# Altium schematic sheet 模拟量输入输出.SchDoc
size A1
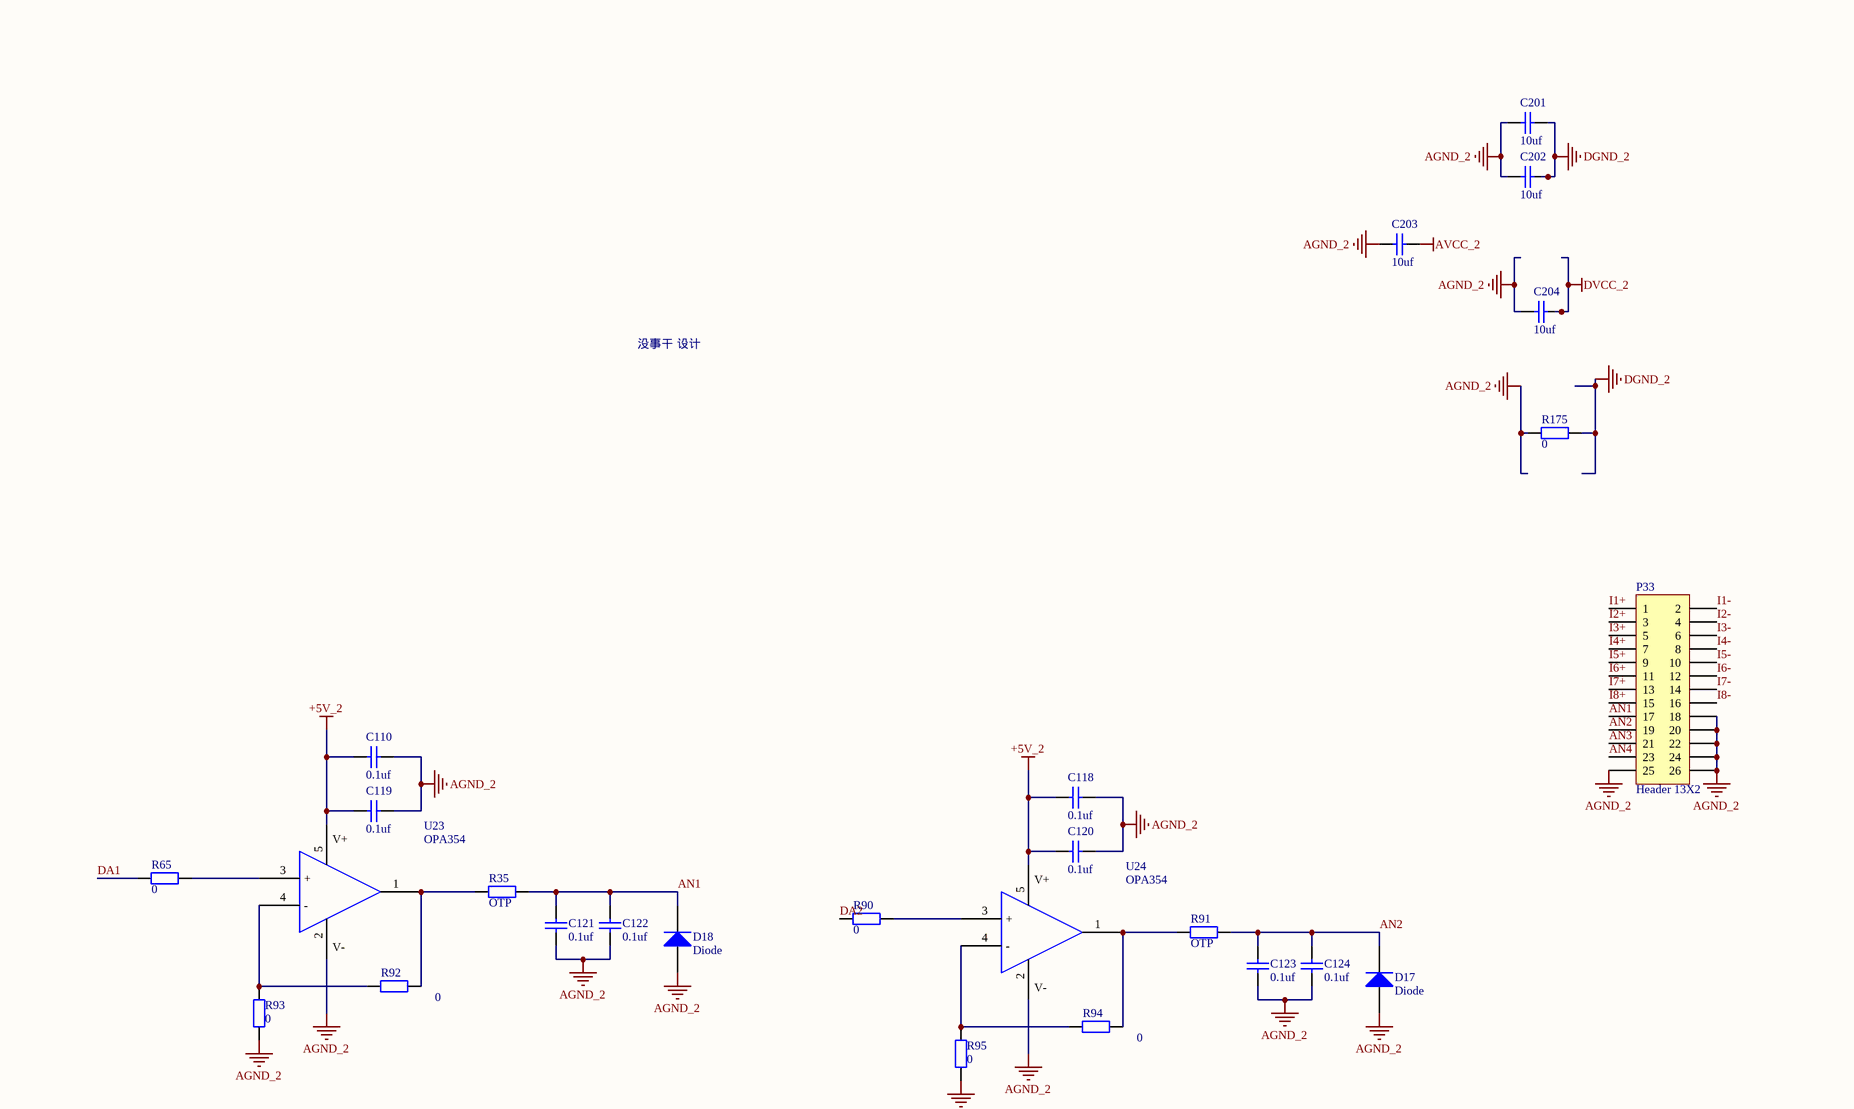
[diagram p0: 模拟量输入输出.SchDoc, top left]
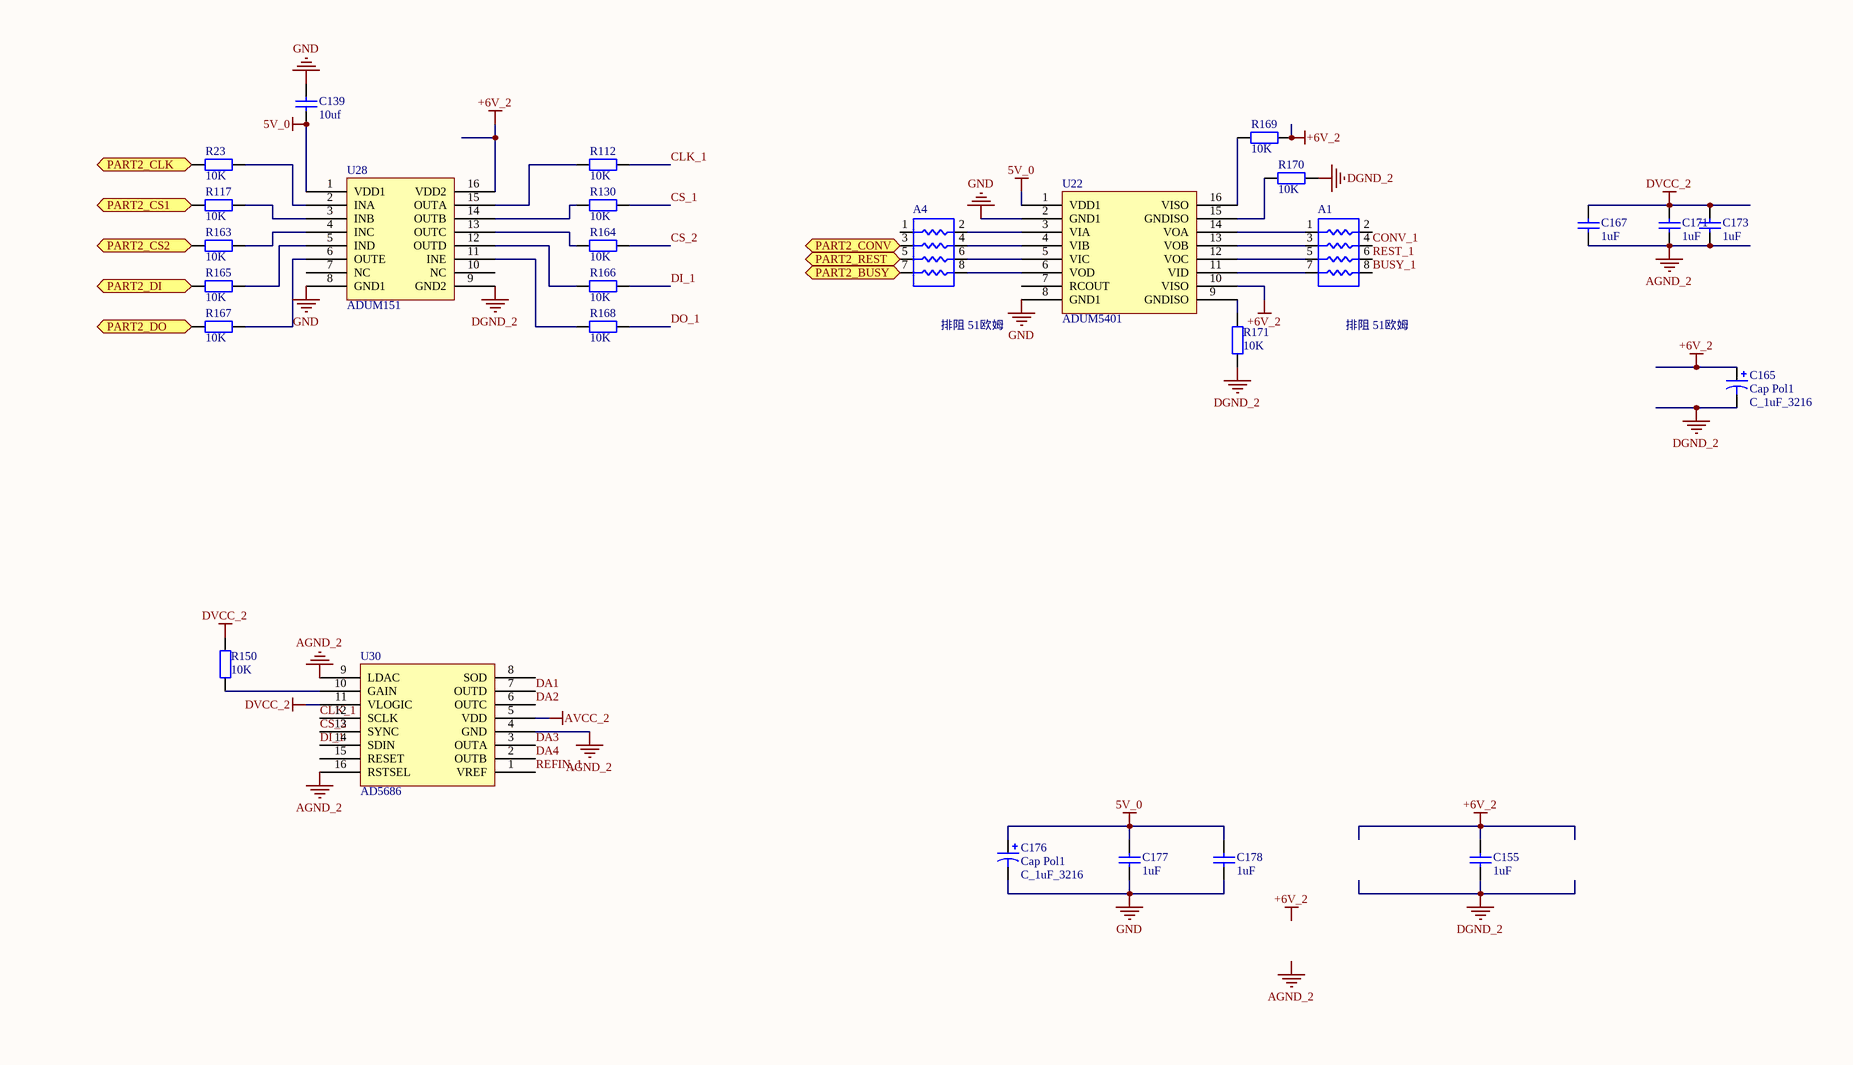
[diagram p1: 模拟量输入输出.SchDoc, top right]
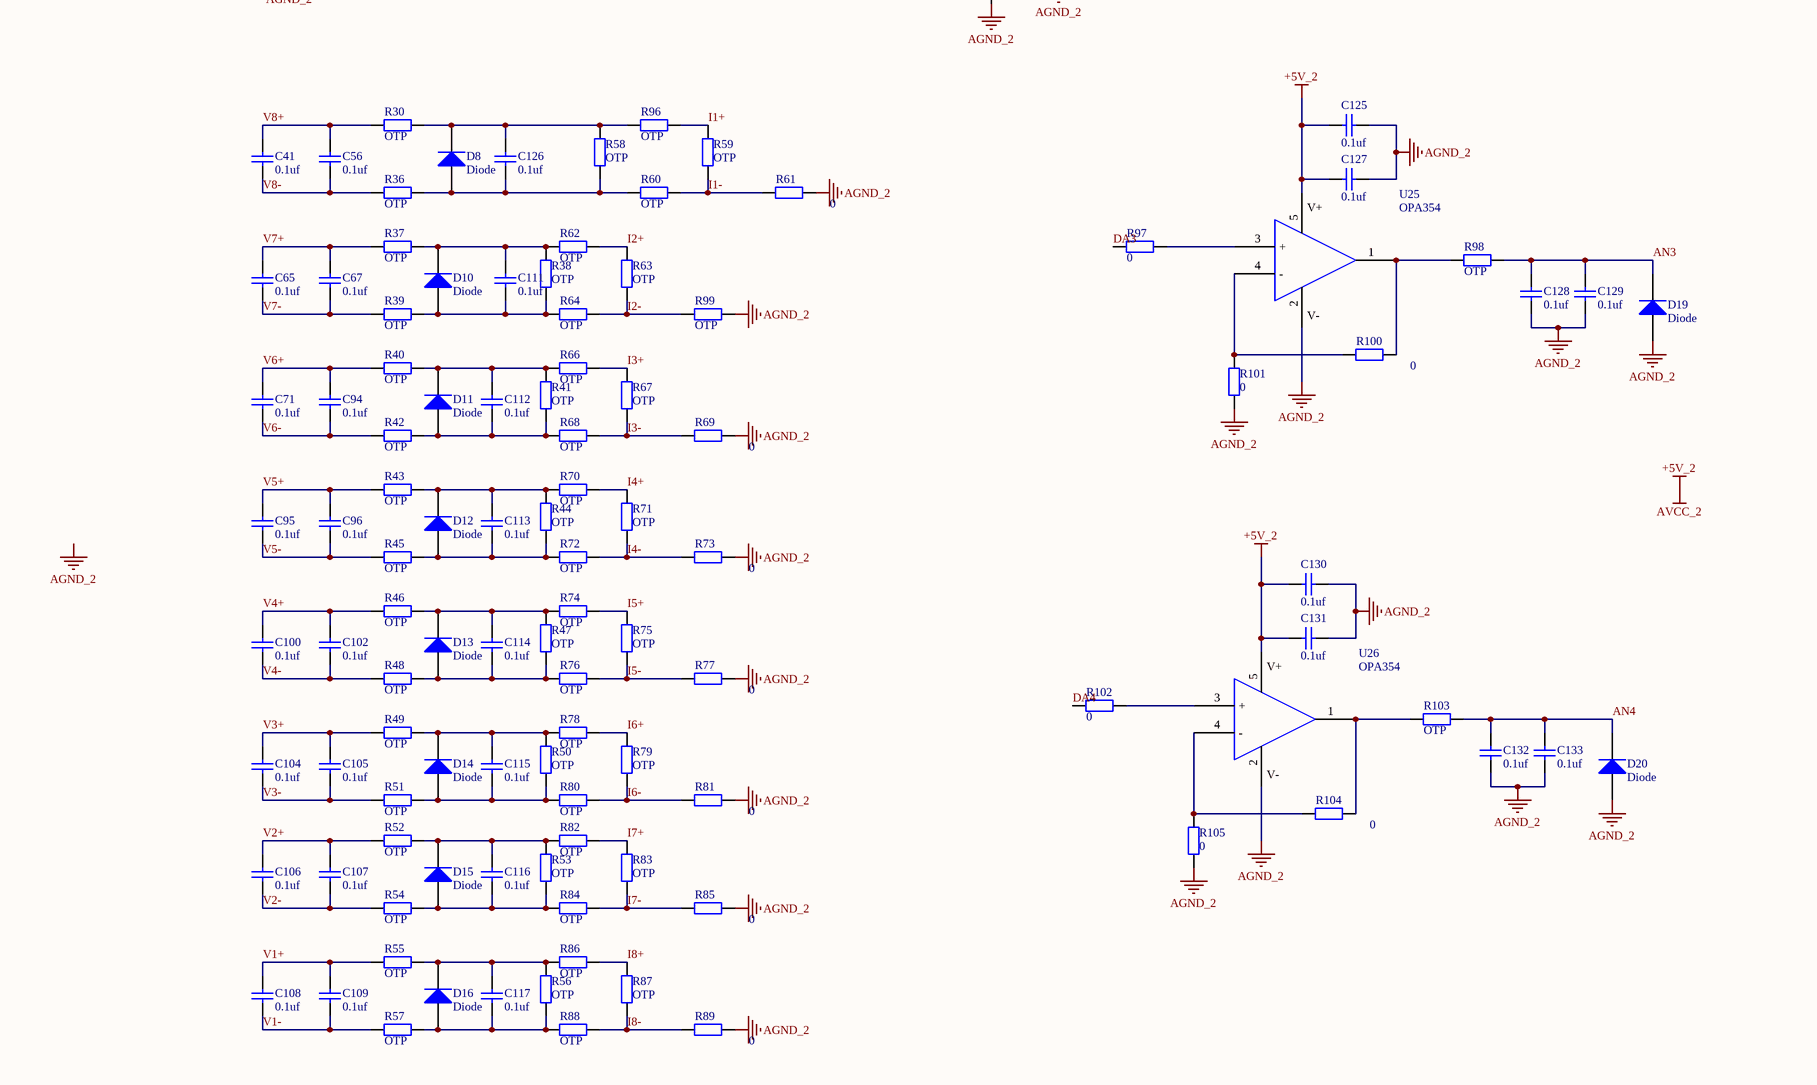
[diagram p2: 模拟量输入输出.SchDoc, bottom left]
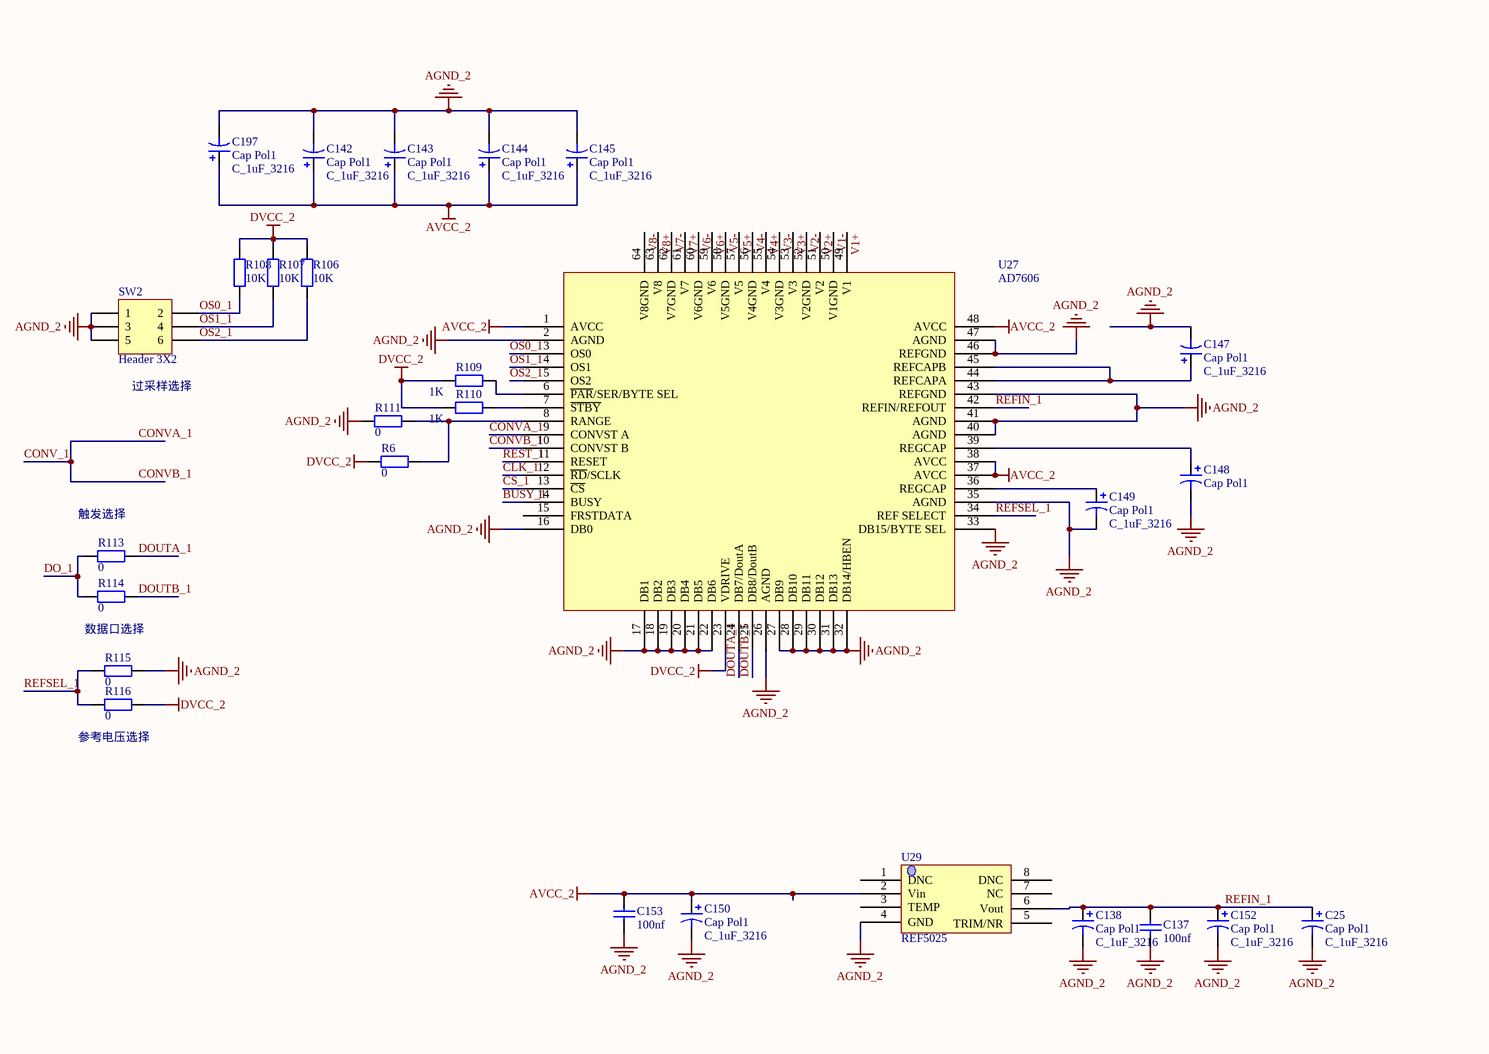
[diagram p3: 模拟量输入输出.SchDoc, bottom right]

## Parts
A1  排阻 51欧姆  [RCA03-4D]
A4  排阻 51欧姆  [RCA03-4D]
C25  Cap Pol1  value C_1uF_3216  [3216]
C41  value 0.1uf  [0805C]  (hidden comment: Cap)
C56  value 0.1uf  [0805C]  (hidden comment: Cap)
C65  value 0.1uf  [0805C]  (hidden comment: Cap)
C67  value 0.1uf  [0805C]  (hidden comment: Cap)
C71  value 0.1uf  [0805C]  (hidden comment: Cap)
C94  value 0.1uf  [0805C]  (hidden comment: Cap)
C95  value 0.1uf  [0805C]  (hidden comment: Cap)
C96  value 0.1uf  [0805C]  (hidden comment: Cap)
C100  value 0.1uf  [0805C]  (hidden comment: Cap)
C102  value 0.1uf  [0805C]  (hidden comment: Cap)
C104  value 0.1uf  [0805C]  (hidden comment: Cap)
C105  value 0.1uf  [0805C]  (hidden comment: Cap)
C106  value 0.1uf  [0805C]  (hidden comment: Cap)
C107  value 0.1uf  [0805C]  (hidden comment: Cap)
C108  value 0.1uf  [0805C]  (hidden comment: Cap)
C109  value 0.1uf  [0805C]  (hidden comment: Cap)
C110  value 0.1uf  [0805C]  (hidden comment: Cap)
C111  value 0.1uf  [0805C]  (hidden comment: Cap)
C112  value 0.1uf  [0805C]  (hidden comment: Cap)
C113  value 0.1uf  [0805C]  (hidden comment: Cap)
C114  value 0.1uf  [0805C]  (hidden comment: Cap)
C115  value 0.1uf  [0805C]  (hidden comment: Cap)
C116  value 0.1uf  [0805C]  (hidden comment: Cap)
C117  value 0.1uf  [0805C]  (hidden comment: Cap)
C118  value 0.1uf  [0805C]  (hidden comment: Cap)
C119  value 0.1uf  [0805C]  (hidden comment: Cap)
C120  value 0.1uf  [0805C]  (hidden comment: Cap)
C121  value 0.1uf  [0805C]  (hidden comment: Cap)
C122  value 0.1uf  [0805C]  (hidden comment: Cap)
C123  value 0.1uf  [0805C]  (hidden comment: Cap)
C124  value 0.1uf  [0805C]  (hidden comment: Cap)
C125  value 0.1uf  [0805C]  (hidden comment: Cap)
C126  value 0.1uf  [0805C]  (hidden comment: Cap)
C127  value 0.1uf  [0805C]  (hidden comment: Cap)
C128  value 0.1uf  [0805C]  (hidden comment: Cap)
C129  value 0.1uf  [0805C]  (hidden comment: Cap)
C130  value 0.1uf  [0805C]  (hidden comment: Cap)
C131  value 0.1uf  [0805C]  (hidden comment: Cap)
C132  value 0.1uf  [0805C]  (hidden comment: Cap)
C133  value 0.1uf  [0805C]  (hidden comment: Cap)
C137  value 100nf  [0805C]  (hidden comment: Cap)
C138  Cap Pol1  value C_1uF_3216  [3216]
C139  value 10uf  [0805C]  (hidden comment: Cap)
C142  Cap Pol1  value C_1uF_3216  [3216]
C143  Cap Pol1  value C_1uF_3216  [3216]
C144  Cap Pol1  value C_1uF_3216  [3216]
C145  Cap Pol1  value C_1uF_3216  [3216]
C147  Cap Pol1  value C_1uF_3216  [3216]
C148  Cap Pol1  [3216]
C149  Cap Pol1  value C_1uF_3216  [3216]
C150  Cap Pol1  value C_1uF_3216  [3216]
C152  Cap Pol1  value C_1uF_3216  [3216]
C153  value 100nf  [0805C]  (hidden comment: Cap)
C155  1uF  [0805C]
C165  Cap Pol1  value C_1uF_3216  [3216]
C167  1uF  [0805C]
C171  1uF  [0805C]
C173  1uF  [0805C]
C176  Cap Pol1  value C_1uF_3216  [3216]
C177  1uF  [0805C]
C178  1uF  [0805C]
C197  Cap Pol1  value C_1uF_3216  [3216]
C201  value 10uf  [0805C]  (hidden comment: Cap)
C202  value 10uf  [0805C]  (hidden comment: Cap)
C203  value 10uf  [0805C]  (hidden comment: Cap)
C204  value 10uf  [0805C]  (hidden comment: Cap)
D8  Diode  [SMA]
D10  Diode  [SMA]
D11  Diode  [SMA]
D12  Diode  [SMA]
D13  Diode  [SMA]
D14  Diode  [SMA]
D15  Diode  [SMA]
D16  Diode  [SMA]
D17  Diode  [SMA]
D18  Diode  [SMA]
D19  Diode  [SMA]
D20  Diode  [SMA]
P33  Header 13X2  [3.5MM-2*12P]
R6  value 0  [0805R]  (hidden comment: Res2)
R23  value 10K  [0805R]  (hidden comment: Res2)
R30  value OTP  [0805R]  (hidden comment: Res2)
R35  value OTP  [0805R]  (hidden comment: Res2)
R36  value OTP  [0805R]  (hidden comment: Res2)
R37  value OTP  [0805R]  (hidden comment: Res2)
R38  value OTP  [0805R]  (hidden comment: Res2)
R39  value OTP  [0805R]  (hidden comment: Res2)
R40  value OTP  [0805R]  (hidden comment: Res2)
R41  value OTP  [0805R]  (hidden comment: Res2)
R42  value OTP  [0805R]  (hidden comment: Res2)
R43  value OTP  [0805R]  (hidden comment: Res2)
R44  value OTP  [0805R]  (hidden comment: Res2)
R45  value OTP  [0805R]  (hidden comment: Res2)
R46  value OTP  [0805R]  (hidden comment: Res2)
R47  value OTP  [0805R]  (hidden comment: Res2)
R48  value OTP  [0805R]  (hidden comment: Res2)
R49  value OTP  [0805R]  (hidden comment: Res2)
R50  value OTP  [0805R]  (hidden comment: Res2)
R51  value OTP  [0805R]  (hidden comment: Res2)
R52  value OTP  [0805R]  (hidden comment: Res2)
R53  value OTP  [0805R]  (hidden comment: Res2)
R54  value OTP  [0805R]  (hidden comment: Res2)
R55  value OTP  [0805R]  (hidden comment: Res2)
R56  value OTP  [0805R]  (hidden comment: Res2)
R57  value OTP  [0805R]  (hidden comment: Res2)
R58  value OTP  [0805R]  (hidden comment: Res2)
R59  value OTP  [FB1206]  (hidden comment: Res2)
R60  value OTP  [0805R]  (hidden comment: Res2)
R61  value 0  [0603AR]  (hidden comment: Res2)
R62  value OTP  [0805R]  (hidden comment: Res2)
R63  value OTP  [FB1206]  (hidden comment: Res2)
R64  value OTP  [0805R]  (hidden comment: Res2)
R65  value 0  [0805R]  (hidden comment: Res2)
R66  value OTP  [0805R]  (hidden comment: Res2)
R67  value OTP  [FB1206]  (hidden comment: Res2)
R68  value OTP  [0805R]  (hidden comment: Res2)
R69  value 0  [0603AR]  (hidden comment: Res2)
R70  value OTP  [0805R]  (hidden comment: Res2)
R71  value OTP  [FB1206]  (hidden comment: Res2)
R72  value OTP  [0805R]  (hidden comment: Res2)
R73  value 0  [0603AR]  (hidden comment: Res2)
R74  value OTP  [0805R]  (hidden comment: Res2)
R75  value OTP  [FB1206]  (hidden comment: Res2)
R76  value OTP  [0805R]  (hidden comment: Res2)
R77  value 0  [0603AR]  (hidden comment: Res2)
R78  value OTP  [0805R]  (hidden comment: Res2)
R79  value OTP  [FB1206]  (hidden comment: Res2)
R80  value OTP  [0805R]  (hidden comment: Res2)
R81  value 0  [0603AR]  (hidden comment: Res2)
R82  value OTP  [0805R]  (hidden comment: Res2)
R83  value OTP  [FB1206]  (hidden comment: Res2)
R84  value OTP  [0805R]  (hidden comment: Res2)
R85  value 0  [0603AR]  (hidden comment: Res2)
R86  value OTP  [0805R]  (hidden comment: Res2)
R87  value OTP  [FB1206]  (hidden comment: Res2)
R88  value OTP  [0805R]  (hidden comment: Res2)
R89  value 0  [0603AR]  (hidden comment: Res2)
R90  value 0  [0805R]  (hidden comment: Res2)
R91  value OTP  [0805R]  (hidden comment: Res2)
R92  value 0  [0805R]  (hidden comment: Res2)
R93  value 0  [0805R]  (hidden comment: Res2)
R94  value 0  [0805R]  (hidden comment: Res2)
R95  value 0  [0805R]  (hidden comment: Res2)
R96  value OTP  [0805R]  (hidden comment: Res2)
R97  value 0  [0805R]  (hidden comment: Res2)
R98  value OTP  [0805R]  (hidden comment: Res2)
R99  value OTP  [0603AR]  (hidden comment: Res2)
R100  value 0  [0805R]  (hidden comment: Res2)
R101  value 0  [0805R]  (hidden comment: Res2)
R102  value 0  [0805R]  (hidden comment: Res2)
R103  value OTP  [0805R]  (hidden comment: Res2)
R104  value 0  [0805R]  (hidden comment: Res2)
R105  value 0  [0805R]  (hidden comment: Res2)
R106  value 10K  [0805R]  (hidden comment: Res2)
R107  value 10K  [0805R]  (hidden comment: Res2)
R108  value 10K  [0805R]  (hidden comment: Res2)
R109  value 1K  [0805R]  (hidden comment: Res2)
R110  value 1K  [0805R]  (hidden comment: Res2)
R111  value 0  [0805R]  (hidden comment: Res2)
R112  value 10K  [0805R]  (hidden comment: Res2)
R113  value 0  [0805R]  (hidden comment: Res2)
R114  value 0  [0805R]  (hidden comment: Res2)
R115  value 0  [0805R]  (hidden comment: Res2)
R116  value 0  [0805R]  (hidden comment: Res2)
R117  value 10K  [0805R]  (hidden comment: Res2)
R130  value 10K  [0805R]  (hidden comment: Res2)
R150  value 10K  [0805R]  (hidden comment: Res2)
R163  value 10K  [0805R]  (hidden comment: Res2)
R164  value 10K  [0805R]  (hidden comment: Res2)
R165  value 10K  [0805R]  (hidden comment: Res2)
R166  value 10K  [0805R]  (hidden comment: Res2)
R167  value 10K  [0805R]  (hidden comment: Res2)
R168  value 10K  [0805R]  (hidden comment: Res2)
R169  value 10K  [0603AR]  (hidden comment: Res2)
R170  value 10K  [0603AR]  (hidden comment: Res2)
R171  value 10K  [0603AR]  (hidden comment: Res2)
R175  value 0  [0805R]  (hidden comment: Res2)
SW2  Header 3X2  [SW_6]
U22  ADUM5401  [SOL-16_L]
U23  OPA354  [SOT23-5]
U24  OPA354  [SOT23-5]
U25  OPA354  [SOT23-5]
U26  OPA354  [SOT23-5]
U27  AD7606  [TQFP64]
U28  ADUM151  [SO16NB]
U29  REF5025  [MSOP8]
U30  AD5686  [TSSOP16]

## Ports
PART2_BUSY, PART2_CLK, PART2_CONV, PART2_CS1, PART2_CS2, PART2_DI, PART2_DO, PART2_REST

## Nets
5V_0: C139.2 C176.1 C177.1 C178.1 U22.1(VDD1) U28.1(VDD1)
+5V_2: C110.2 C118.2 C119.2 C120.2 C125.2 C127.2 C130.2 C131.2 C142.1 C143.1 C144.1 C145.1 C150.1 C153.2 C197.1 C203.1 U23.5(V+) U24.5(V+) U25.5(V+) U26.5(V+) U27.1(AVCC) U27.37(AVCC) U27.38(AVCC) U27.48(AVCC) U29.2(Vin) U30.5(VDD)  [also labelled AVCC_2]
+6V_2: C155.1 C165.1 R169.1 U22.10(VISO) U28.16(VDD2)
AGND_2: C25.2 C110.1 C118.1 C119.1 C120.1 C121.1 C122.1 C123.1 C124.1 C125.1 C127.1 C128.1 C129.1 C130.1 C131.1 C132.1 C133.1 C137.1 C138.2 C142.2 C143.2 C144.2 C145.2 C147.2 C148.2 C149.2 C150.2 C152.2 C153.1 C167.2 C171.2 C173.2 C197.2 C201.2 C202.2 C203.2 C204.2 D17.1(A) D18.1(A) D19.1(A) D20.1(A) P33.18 P33.20 P33.22 P33.24 P33.25 P33.26 R61.1 R69.1 R73.1 R77.1 R81.1 R85.1 R89.1 R93.2 R95.2 R99.1 R101.2 R105.2 R111.2 R115.1 R175.2 SW2.1 SW2.3 SW2.5 U23.2(V-) U24.2(V-) U25.2(V-) U26.2(V-) U27.2(AGND) U27.16(DB0) U27.17(DB1) U27.18(DB2) U27.19(DB3) U27.20(DB4) U27.21(DB5) U27.22(DB6) U27.26(AGND) U27.27(DB9) U27.28(DB10) U27.29(DB11) U27.30(DB12) U27.31(DB13) U27.32(DB14/HBEN) U27.33(DB15/BYTE_SEL) U27.35(AGND) U27.40(AGND) U27.41(AGND) U27.43(REFGND) U27.46(REFGND) U27.47(AGND) U29.4(GND) U30.4(GND) U30.9(LDAC) U30.16(RSTSEL)
DGND_2: C155.2 C165.2 C201.1 C202.1 R170.1 R171.2 R175.1 U28.9(GND2)
DVCC_2: C167.1 C171.1 C173.1 C204.1 R6.2 R106.1 R107.1 R108.1 R109.2 R110.2 R116.1 R150.1 U27.23(VDRIVE) U30.11(VLOGIC)
GND: C139.1 C176.2 C177.2 C178.2 U22.2(GND1) U22.8(GND1) U28.8(GND1)
AN1: C121.2 C122.2 D18.2(K) P33.17 R35.2
AN2: C123.2 C124.2 D17.2(K) P33.19 R91.2
AN3: C128.2 C129.2 D19.2(K) P33.21 R98.2
AN4: C132.2 C133.2 D20.2(K) P33.23 R103.2
BUSY_1: A1.8 U27.14(BUSY)
CLK_1: R112.1 U27.12(~{RD}/SCLK) U30.12(SCLK)
CONV_1: A1.4 U27.9(CONVST_A) U27.10(CONVST_B)  [also labelled CONVA_1, CONVB_1]
CS_1: R130.1 U27.13(~{CS})
CS_2: R164.1 U30.13(SYNC)
DA1: R65.1 U30.7(OUTD)
DA2: R90.1 U30.6(OUTC)
DA3: R97.1 U30.3(OUTA)
DA4: R102.1 U30.2(OUTB)
DI_1: R166.1 U30.14(SDIN)
DO_1: R113.1 R114.1 R168.1
DOUTA_1: R113.2 U27.24(DB7/DoutA)
DOUTB_1: R114.2 U27.25(DB8/DoutB)
I1+: P33.1 R59.2 R96.2
I1-: P33.2 R59.1 R60.2 R61.2
I2+: P33.3 R62.2 R63.1
I2-: P33.4 R63.2 R64.2 R99.2
I3+: P33.5 R66.2 R67.1
I3-: P33.6 R67.2 R68.2 R69.2
I4+: P33.7 R70.2 R71.1
I4-: P33.8 R71.2 R72.2 R73.2
I5+: P33.9 R74.2 R75.1
I5-: P33.10 R75.2 R76.2 R77.2
I6+: P33.11 R78.2 R79.1
I6-: P33.12 R79.2 R80.2 R81.2
I7+: P33.13 R82.2 R83.1
I7-: P33.14 R83.2 R84.2 R85.2
I8+: P33.15 R86.2 R87.1
I8-: P33.16 R87.2 R88.2 R89.2
OS0_1: R108.2 SW2.2 U27.3(OS0)
OS1_1: R107.2 SW2.4 U27.4(OS1)
OS2_1: R106.2 SW2.6 U27.5(OS2)
PART2_BUSY: A4.7 ; port PART2_BUSY
PART2_CLK: R23.2 ; port PART2_CLK
PART2_CONV: A4.3 ; port PART2_CONV
PART2_CS1: R117.2 ; port PART2_CS1
PART2_CS2: R163.2 ; port PART2_CS2
PART2_DI: R165.2 ; port PART2_DI
PART2_DO: R167.2 ; port PART2_DO
PART2_REST: A4.5 ; port PART2_REST
REFIN_1: C25.1 C137.2 C138.1 C152.1 U27.42(REFIN/REFOUT) U29.6(Vout) U30.1(VREF)
REFSEL_1: R115.2 R116.2 U27.34(REF_SELECT)
REST_1: A1.6 U27.11(RESET)
V1+: C108.2 C109.2 R55.2 U27.49(V1)
V1-: C108.1 C109.1 R57.2 U27.50(V1GND)
V2+: C106.2 C107.2 R52.2 U27.51(V2)
V2-: C106.1 C107.1 R54.2 U27.52(V2GND)
V3+: C104.2 C105.2 R49.2 U27.53(V3)
V3-: C104.1 C105.1 R51.2 U27.54(V3GND)
V4+: C100.2 C102.2 R46.2 U27.55(V4)
V4-: C100.1 C102.1 R48.2 U27.56(V4GND)
V5+: C95.2 C96.2 R43.2 U27.57(V5)
V5-: C95.1 C96.1 R45.2 U27.58(V5GND)
V6+: C71.2 C94.2 R40.2 U27.59(V6)
V6-: C71.1 C94.1 R42.2 U27.60(V6GND)
V7+: C65.2 C67.2 R37.2 U27.61(V7)
V7-: C65.1 C67.1 R39.2 U27.62(V7GND)
V8+: C41.2 C56.2 R30.2 U27.63(V8)
V8-: C41.1 C56.1 R36.2 U27.64(V8GND)
NetA1_1: A1.1 U22.14(VOA)
NetA1_3: A1.3 U22.13(VOB)
NetA1_5: A1.5 U22.12(VOC)
NetA1_7: A1.7 U22.11(VID)
NetA4_2: A4.2 U22.3(VIA)
NetA4_4: A4.4 U22.4(VIB)
NetA4_6: A4.6 U22.5(VIC)
NetA4_8: A4.8 U22.6(VOD)
NetC111_1: C111.1 D10.1(A) R38.2 R39.1 R64.1
NetC111_2: C111.2 D10.2(K) R37.1 R38.1 R62.1
NetC112_1: C112.1 D11.1(A) R41.2 R42.1 R68.1
NetC112_2: C112.2 D11.2(K) R40.1 R41.1 R66.1
NetC113_1: C113.1 D12.1(A) R44.2 R45.1 R72.1
NetC113_2: C113.2 D12.2(K) R43.1 R44.1 R70.1
NetC114_1: C114.1 D13.1(A) R47.2 R48.1 R76.1
NetC114_2: C114.2 D13.2(K) R46.1 R47.1 R74.1
NetC115_1: C115.1 D14.1(A) R50.2 R51.1 R80.1
NetC115_2: C115.2 D14.2(K) R49.1 R50.1 R78.1
NetC116_1: C116.1 D15.1(A) R53.2 R54.1 R84.1
NetC116_2: C116.2 D15.2(K) R52.1 R53.1 R82.1
NetC117_1: C117.1 D16.1(A) R56.2 R57.1 R88.1
NetC117_2: C117.2 D16.2(K) R55.1 R56.1 R86.1
NetC126_1: C126.1 D8.1(A) R36.1 R58.1 R60.1
NetC126_2: C126.2 D8.2(K) R30.1 R58.2 R96.1
NetC147_1: C147.1 U27.44(REFCAPA) U27.45(REFCAPB)
NetC148_1: C148.1 U27.39(REGCAP)
NetC149_1: C149.1 U27.36(REGCAP)
NetR6_1: R6.1 R111.1 U27.8(RANGE)
NetR23_1: R23.1 U28.2(INA)
NetR35_1: R35.1 R92.1 U23.1(OUT)
NetR65_2: R65.2 U23.3(+)
NetR90_2: R90.2 U24.3(+)
NetR91_1: R91.1 R94.1 U24.1(OUT)
NetR92_2: R92.2 R93.1 U23.4(-)
NetR94_2: R94.2 R95.1 U24.4(-)
NetR97_2: R97.2 U25.3(+)
NetR98_1: R98.1 R100.1 U25.1(OUT)
NetR100_2: R100.2 R101.1 U25.4(-)
NetR102_2: R102.2 U26.3(+)
NetR103_1: R103.1 R104.1 U26.1(OUT)
NetR104_2: R104.2 R105.1 U26.4(-)
NetR109_1: R109.1 U27.6(~{PAR}/SER/BYTE_SEL)
NetR110_1: R110.1 U27.7(~{STBY})
NetR112_2: R112.2 U28.15(OUTA)
NetR117_1: R117.1 U28.3(INB)
NetR130_2: R130.2 U28.14(OUTB)
NetR150_2: R150.2 U30.10(GAIN)
NetR163_1: R163.1 U28.4(INC)
NetR164_2: R164.2 U28.13(OUTC)
NetR165_1: R165.1 U28.5(IND)
NetR166_2: R166.2 U28.12(OUTD)
NetR167_1: R167.1 U28.6(OUTE)
NetR168_2: R168.2 U28.11(INE)
NetR169_2: R169.2 U22.16(VISO)
NetR170_2: R170.2 U22.15(GNDISO)
NetR171_1: R171.1 U22.9(GNDISO)

Not connected (* = marked no-connect by the designer): A1 2; A4 1; U22 7(RCOUT); U27 15(FRSTDATA); U28 7(NC) 10(NC); U29 1(DNC) 3(TEMP) 5(TRIM/NR) 7(NC) 8(DNC); U30 8(SOD) 15(RESET)

## Notes on the sheet
- 没事干 设计
- (near SW2) 过采样选择
- (near R113) 触发选择
- 数据口选择
- (near R116) 参考电压选择
- Labels drawn without touching a wire or pin: +6V_2, AGND_2

## Library data of the parts
A1 A4 = RESPACK5
C25 C138 C142-C145 C147-C150 C152 C165 C176 C197 = Cap Pol1: Polarized Capacitor (Radial); Published: 8-Jun-2000; LatestRevisionDate: 17-Jul-2002; LatestRevisionNote: Re-released for DXP Platform.; PackageReference: RB7.6-15; Publisher: Altium Limited
C41 C56 C65 C67 C71 C94-C96 C100 C102 C104-C133 C137 C139 C153 C155 C167 C171 C173 C177 C178 C201-C204 = Cap: Capacitor; Published: 8-Jun-2000; LatestRevisionDate: 17-Jul-2002; LatestRevisionNote: Re-released for DXP Platform.; PackageReference: RAD-0.3; Publisher: Altium Limited; PackageDescription: Radial Cap, Thru-Hole; 2 Leads; 0.3 in Pin Spacing
  C155 C167 C171 C173 C177 C178: Value: 1uF
D8 D10-D20 = Diode: Default Diode; Published: 8-Jun-2000; LatestRevisionDate: 17-Jul-2002; LatestRevisionNote: Re-released for DXP Platform.; PackageVersion: Sep-1996; PackageReference: SMC; Publisher: Altium Limited; PackageDescription: DO-214-AB/SMC; 2 C-Bend Leads; Body 7.9 x 5.9 mm, inc. leads (LxW); Code_JEDEC: DO-214-AB
P33 = Header 13X2: Header, 13-Pin, Dual row; LatestRevisionDate: 17-Jul-2002; LatestRevisionNote: Re-released for DXP Platform.; Publisher: Altium Limited
R6 R23 R30 R35-R117 R130 R150 R163-R171 R175 = Res2: Resistor; Published: 8-Jun-2000; LatestRevisionDate: 17-Jul-2002; LatestRevisionNote: Re-released for DXP Platform.; PackageReference: AXIAL-0.4; Publisher: Altium Limited; PackageDescription: Axial Device, Thru-Hole; 2 Leads; 0.4 in Pin Spacing
SW2 = Header 3X2: Header, 3-Pin, Dual row; LatestRevisionDate: 17-Jul-2002; LatestRevisionNote: Re-released for DXP Platform.; Publisher: Altium Limited
U23-U26 = OPA354: 250MHz, Rail-to-Rail I/O, CMOS